# EAGLE design Tello_Power_PCB_XT30_Extension (EAGLE 9.6.2)
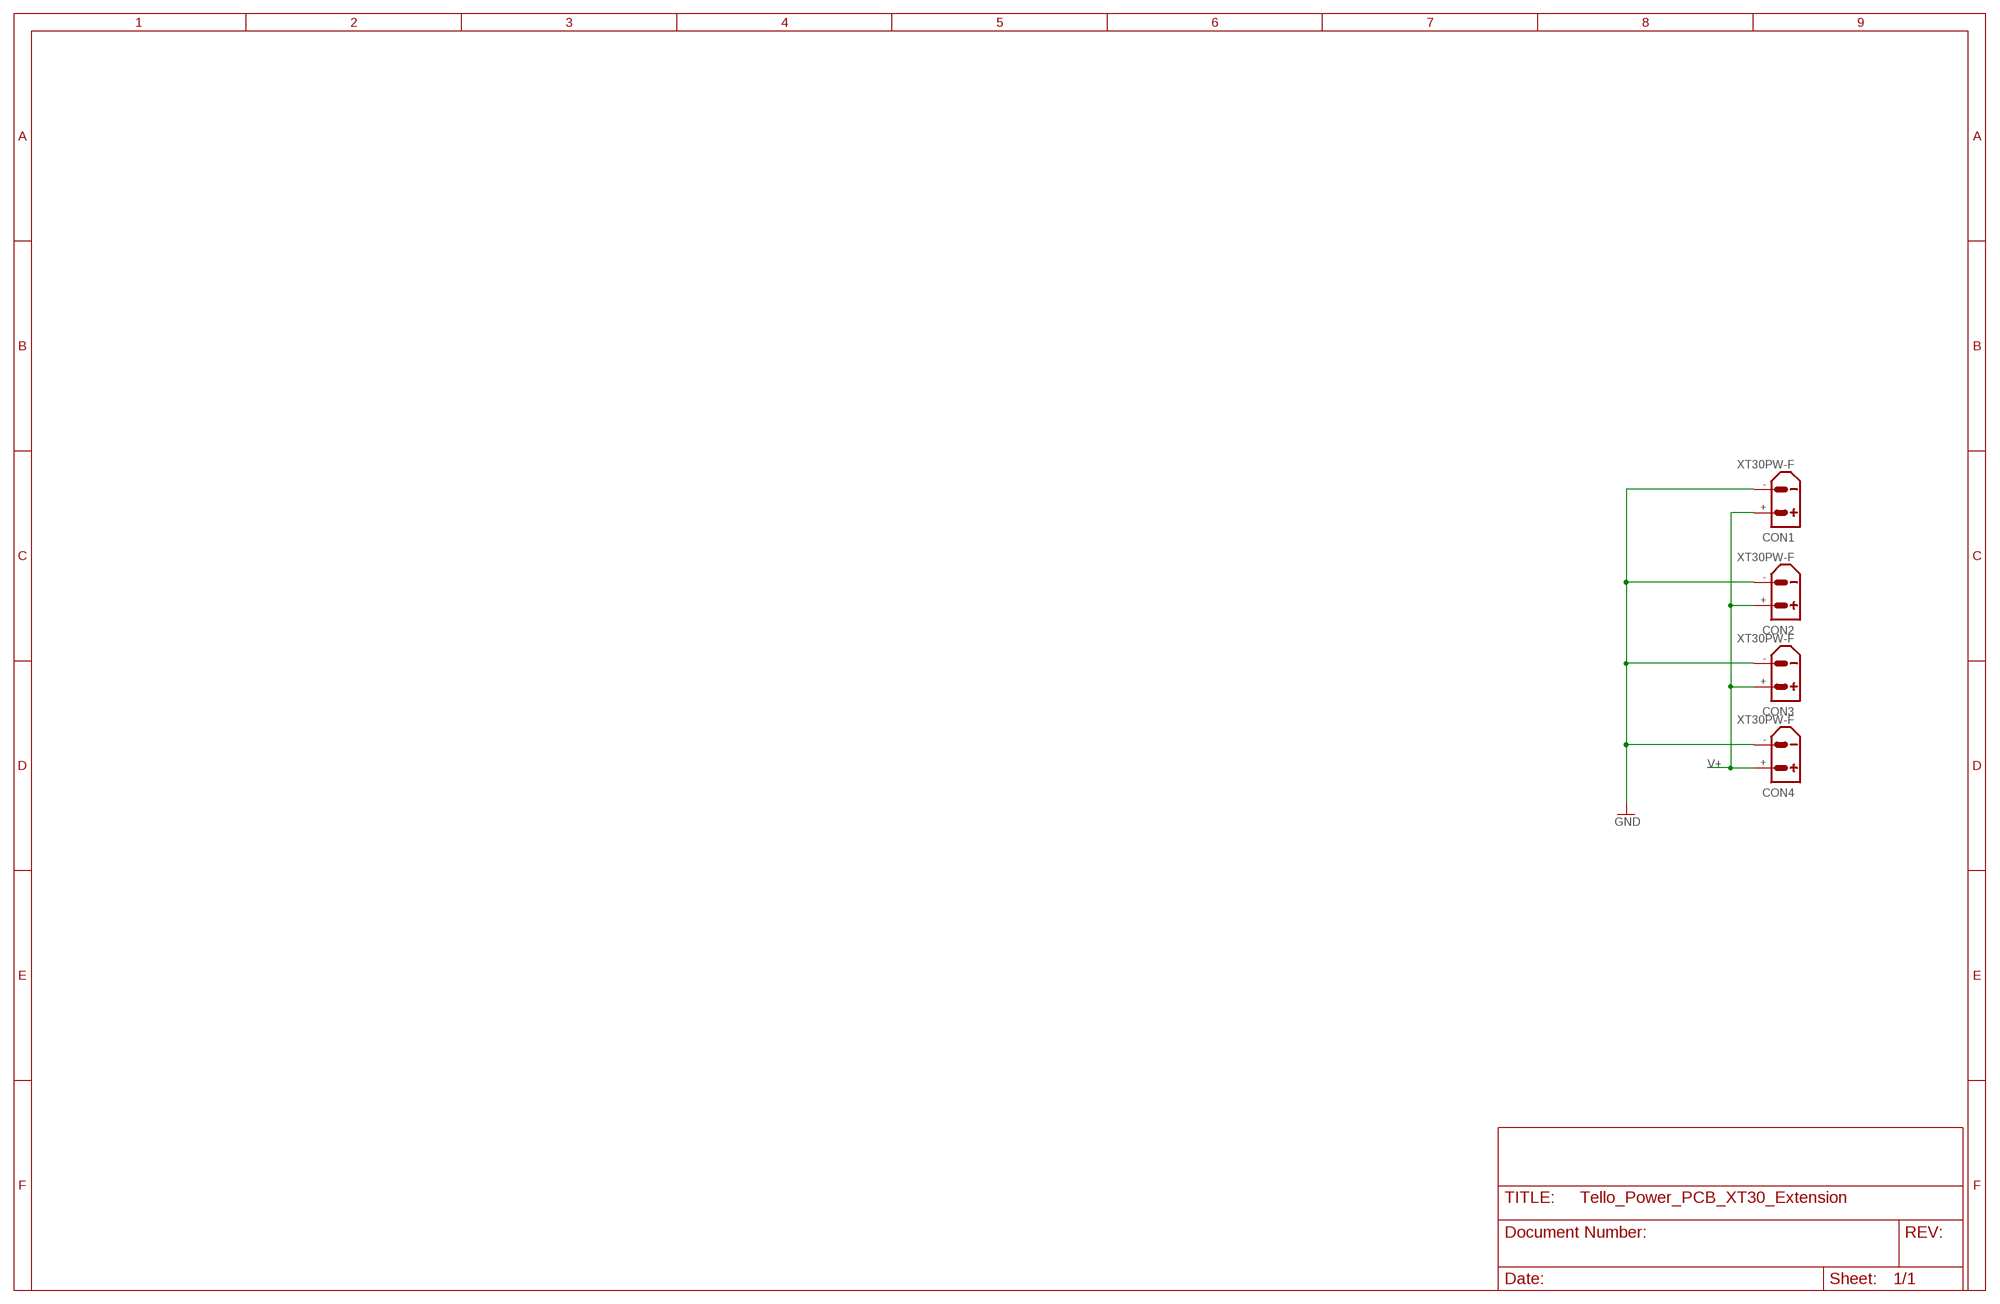
[diagram p0: schematic, sheet 1]

## Parts
CON1  XT30PW-F  [XT30PW-F]
CON2  XT30PW-F  [XT30PW-F]
CON3  XT30PW-F  [XT30PW-F]
CON4  XT30PW-F  [XT30PW-F]

## Nets
GND: CON1.- CON2.- CON3.- CON4.-
V+: CON1.+ CON2.+ CON3.+ CON4.+

## Library data of the parts
CON1-CON4 = amass:XT30: AMASS XT30 connector Store in Japan AMASS XT30 connector <https://szc.jp/ams-xt30>

## Board
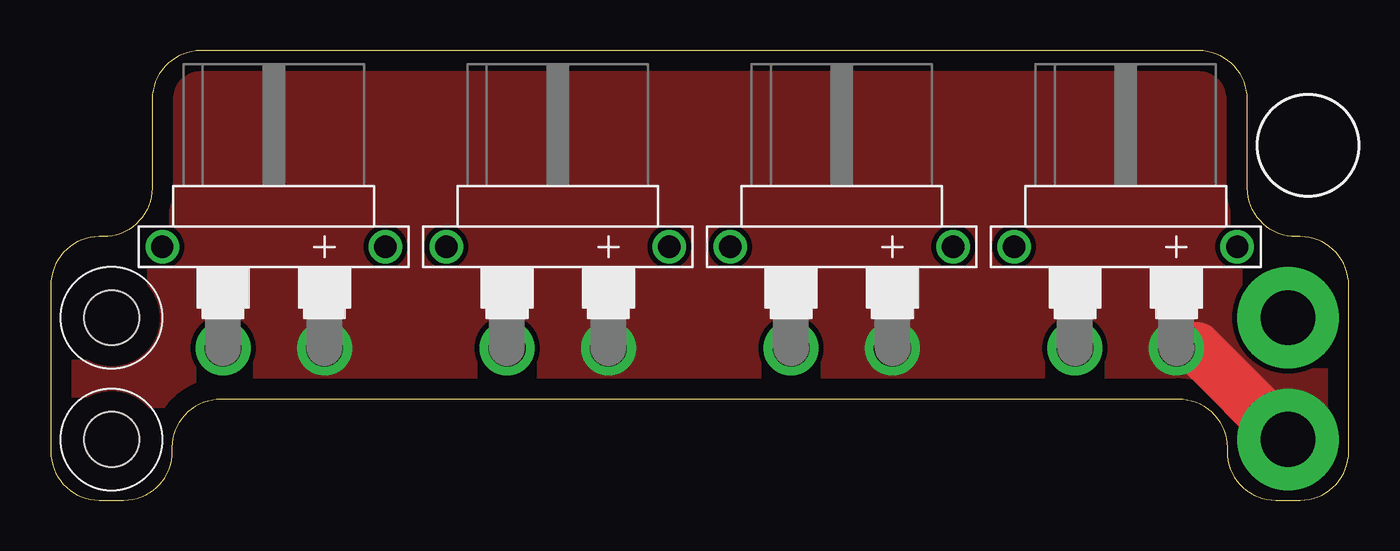
[diagram p1: board, top side]
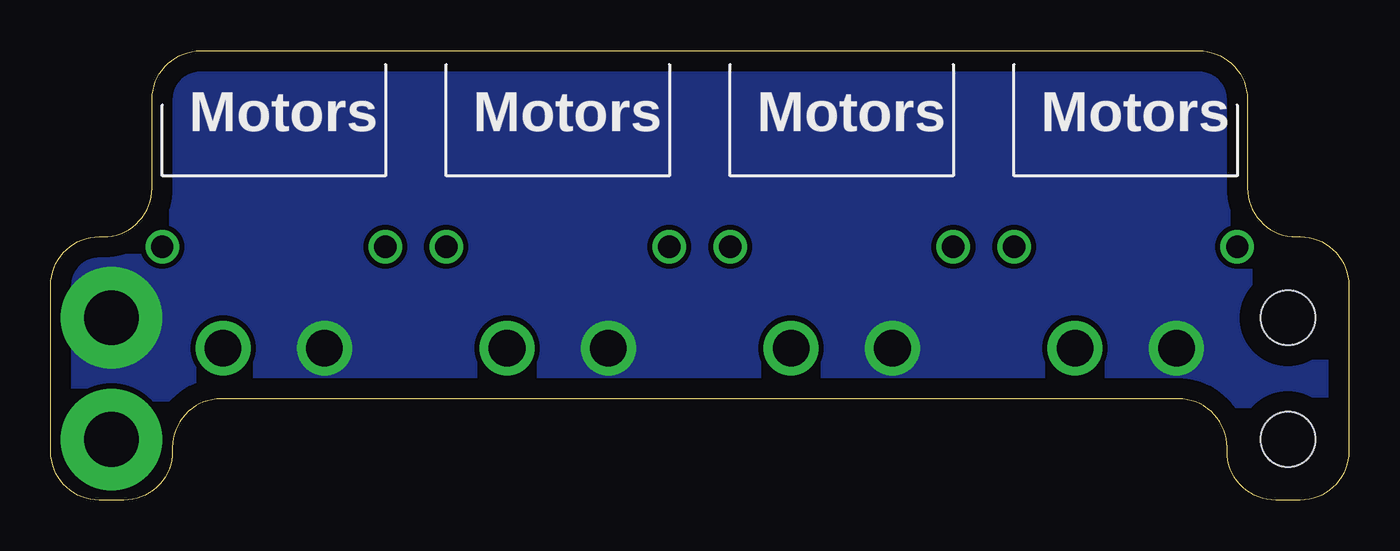
[diagram p2: board, bottom side, seen from below]

Size 64 x 22.18 mm. Coordinates in mm from the lower left corner, seen from the top.
Outline: 56.6,22.18 7.4,22.18 arc90 5,19.77 5,15.4 arc-90 2.6,13 2.4,13 arc90 0,10.6 0,2.4 arc90 2.4,0 3.6,0 arc90 6,2.4 6,2.6 arc-90 8.4,5 55.6,5 arc-90 58,2.6 58,2.4 arc90 60.4,0 61.6,0 arc90 64,2.4 64,10.6 arc90 61.6,13 61.4,13 arc-90 59,15.4 59,19.77 arc90 56.6,22.18
Copper layers (1*16): Top 0.035mm / dielectric 1.5mm / Bottom 0.035mm
Design rules "default": minimum track width 6mil, minimum drill 0.35mm, track to track 6mil, track to pad 6mil, pad to pad 6mil, via to via 6mil, smd to smd 6mil, copper to edge 40mil, drill to drill 6mil, minimum pad ring 10mil, minimum via ring 8mil, stop-mask expansion 4mil, vias tented up to drill 0mil, thermal gap 10mil
Holes 2.7 mm at 3,3 3,9

### Footprints (pad centres in the part's own frame; a part is rotated, then mirrored left to right if it is on the bottom)
XT30PW-F = drill 1.8: + 2.5,0; - -2.5,0 | drill 1.1: P$3 -5.5,5; P$4 5.5,5

### Placement (x,y rotation side)
CON1  11,7.5 0 top
CON2  25,7.5 0 top
CON3  39,7.5 0 top
CON4  53,7.5 0 top

### Tracks (layer width: path | path; a pad name or v marks a point on that pad's centre or on a via)
GND  (via drill 2.7 pad 5)
  other vias: 61,9
  pour Bottom (isolate 0.254, no thermals): -1,23 66,23 66,-1 -1,-1
V+  (via drill 2.7 pad 5)
  Top 2.54: v61,3 56.5,7.5 CON4.+
  pour Top (isolate 0.254, no thermals): 66,23 66,23 66,-1 -1,-1 -1,23

### Text on the board
bPlace: Motors | Motors | Motors | Motors